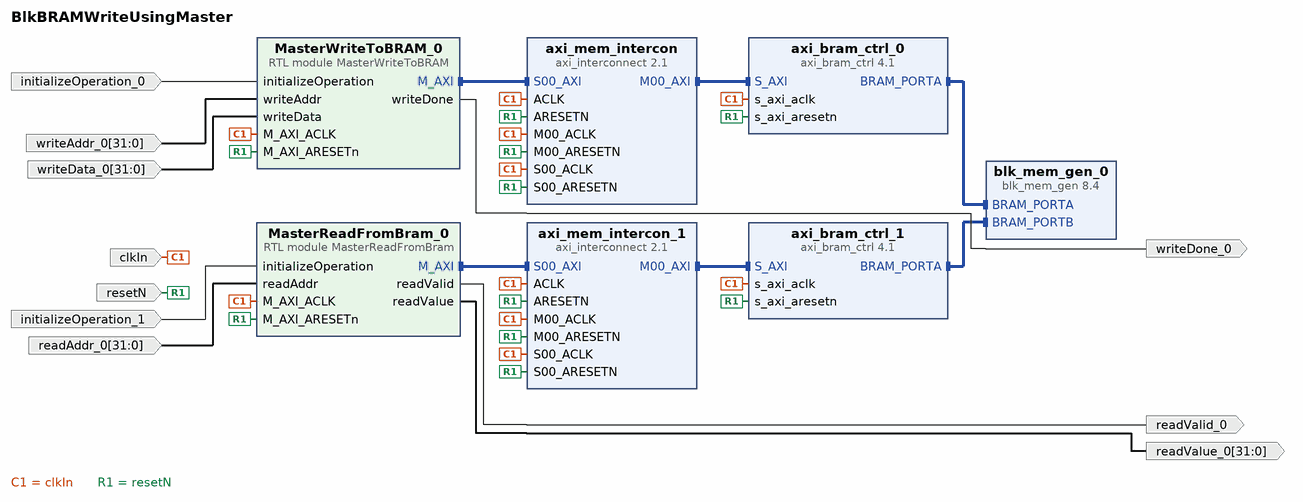
[diagram p0: block diagram of the top level]
# Vivado block design BlkBRAMWriteUsingMaster, xc7z010clg400-1, Vivado 2019.1
create_bd_design BlkBRAMWriteUsingMaster

create_bd_port -dir I resetN
create_bd_port -dir I clkIn
create_bd_port -dir I initializeOperation_0
create_bd_port -dir I -from 31 -to 0 writeAddr_0
create_bd_port -dir I -from 31 -to 0 writeData_0
create_bd_port -dir O writeDone_0
create_bd_port -dir I initializeOperation_1
create_bd_port -dir I -from 31 -to 0 readAddr_0
create_bd_port -dir O readValid_0
create_bd_port -dir O -from 31 -to 0 readValue_0

create_bd_cell -type ip -vlnv xilinx.com:ip:blk_mem_gen:8.4 blk_mem_gen_0
set_property -dict [list \
  CONFIG.Enable_B Use_ENB_Pin \
  CONFIG.Memory_Type True_Dual_Port_RAM \
  CONFIG.Port_B_Clock 100 \
  CONFIG.Port_B_Enable_Rate 100 \
  CONFIG.Port_B_Write_Rate 50 \
  CONFIG.Use_RSTB_Pin true \
] [get_bd_cells blk_mem_gen_0]
create_bd_cell -type ip -vlnv xilinx.com:ip:axi_bram_ctrl:4.1 axi_bram_ctrl_0
set_property -dict {CONFIG.PROTOCOL AXI4LITE CONFIG.SINGLE_PORT_BRAM 1} [get_bd_cells axi_bram_ctrl_0]
create_bd_cell -type module -reference MasterWriteToBRAM MasterWriteToBRAM_0
create_bd_cell -type ip -vlnv xilinx.com:ip:axi_interconnect:2.1 axi_mem_intercon
set_property -dict {CONFIG.NUM_MI 1} [get_bd_cells axi_mem_intercon]
create_bd_cell -type module -reference MasterReadFromBram MasterReadFromBram_0
create_bd_cell -type ip -vlnv xilinx.com:ip:axi_bram_ctrl:4.1 axi_bram_ctrl_1
set_property -dict {CONFIG.PROTOCOL AXI4LITE CONFIG.SINGLE_PORT_BRAM 1} [get_bd_cells axi_bram_ctrl_1]
create_bd_cell -type ip -vlnv xilinx.com:ip:axi_interconnect:2.1 axi_mem_intercon_1
set_property -dict {CONFIG.NUM_MI 1} [get_bd_cells axi_mem_intercon_1]

# ---- connections ----

connect_bd_intf_net [get_bd_intf_pins axi_mem_intercon_1/M00_AXI] [get_bd_intf_pins axi_bram_ctrl_1/S_AXI]
connect_bd_intf_net [get_bd_intf_pins MasterReadFromBram_0/M_AXI] [get_bd_intf_pins axi_mem_intercon_1/S00_AXI]
connect_bd_intf_net [get_bd_intf_pins MasterWriteToBRAM_0/M_AXI] [get_bd_intf_pins axi_mem_intercon/S00_AXI]
connect_bd_intf_net [get_bd_intf_pins axi_mem_intercon/M00_AXI] [get_bd_intf_pins axi_bram_ctrl_0/S_AXI]
connect_bd_intf_net [get_bd_intf_pins blk_mem_gen_0/BRAM_PORTA] [get_bd_intf_pins axi_bram_ctrl_0/BRAM_PORTA]
connect_bd_intf_net [get_bd_intf_pins blk_mem_gen_0/BRAM_PORTB] [get_bd_intf_pins axi_bram_ctrl_1/BRAM_PORTA]
connect_bd_net -net S00_ACLK_1 [get_bd_ports clkIn] \
  [get_bd_pins MasterWriteToBRAM_0/M_AXI_ACLK] [get_bd_pins axi_mem_intercon/S00_ACLK] \
  [get_bd_pins axi_bram_ctrl_0/s_axi_aclk] [get_bd_pins axi_mem_intercon/M00_ACLK] [get_bd_pins axi_mem_intercon/ACLK] \
  [get_bd_pins MasterReadFromBram_0/M_AXI_ACLK] [get_bd_pins axi_mem_intercon_1/S00_ACLK] \
  [get_bd_pins axi_bram_ctrl_1/s_axi_aclk] [get_bd_pins axi_mem_intercon_1/M00_ACLK] [get_bd_pins axi_mem_intercon_1/ACLK]
connect_bd_net -net S00_ARESETN_1 [get_bd_ports resetN] \
  [get_bd_pins MasterWriteToBRAM_0/M_AXI_ARESETn] [get_bd_pins axi_mem_intercon/S00_ARESETN] \
  [get_bd_pins axi_bram_ctrl_0/s_axi_aresetn] [get_bd_pins axi_mem_intercon/M00_ARESETN] \
  [get_bd_pins axi_mem_intercon/ARESETN] [get_bd_pins MasterReadFromBram_0/M_AXI_ARESETn] \
  [get_bd_pins axi_mem_intercon_1/S00_ARESETN] [get_bd_pins axi_bram_ctrl_1/s_axi_aresetn] \
  [get_bd_pins axi_mem_intercon_1/M00_ARESETN] [get_bd_pins axi_mem_intercon_1/ARESETN]
connect_bd_net -net initializeOperation_0_1 [get_bd_ports initializeOperation_0] [get_bd_pins MasterWriteToBRAM_0/initializeOperation]
connect_bd_net -net writeAddr_0_1 [get_bd_ports writeAddr_0] [get_bd_pins MasterWriteToBRAM_0/writeAddr]
connect_bd_net -net writeData_0_1 [get_bd_ports writeData_0] [get_bd_pins MasterWriteToBRAM_0/writeData]
connect_bd_net [get_bd_pins MasterWriteToBRAM_0/writeDone] [get_bd_ports writeDone_0]
connect_bd_net -net initializeOperation_1_1 [get_bd_ports initializeOperation_1] [get_bd_pins MasterReadFromBram_0/initializeOperation]
connect_bd_net -net readAddr_0_1 [get_bd_ports readAddr_0] [get_bd_pins MasterReadFromBram_0/readAddr]
connect_bd_net [get_bd_pins MasterReadFromBram_0/readValid] [get_bd_ports readValid_0]
connect_bd_net [get_bd_pins MasterReadFromBram_0/readValue] [get_bd_ports readValue_0]

# ---- address map ----
assign_bd_address -offset 0xC0000000 -range 8K -target_address_space [get_bd_addr_spaces MasterReadFromBram_0/M_AXI] [get_bd_addr_segs axi_bram_ctrl_1/S_AXI/Mem0]
assign_bd_address -offset 0xC0000000 -range 8K -target_address_space [get_bd_addr_spaces MasterWriteToBRAM_0/M_AXI] [get_bd_addr_segs axi_bram_ctrl_0/S_AXI/Mem0]

validate_bd_design
save_bd_design
